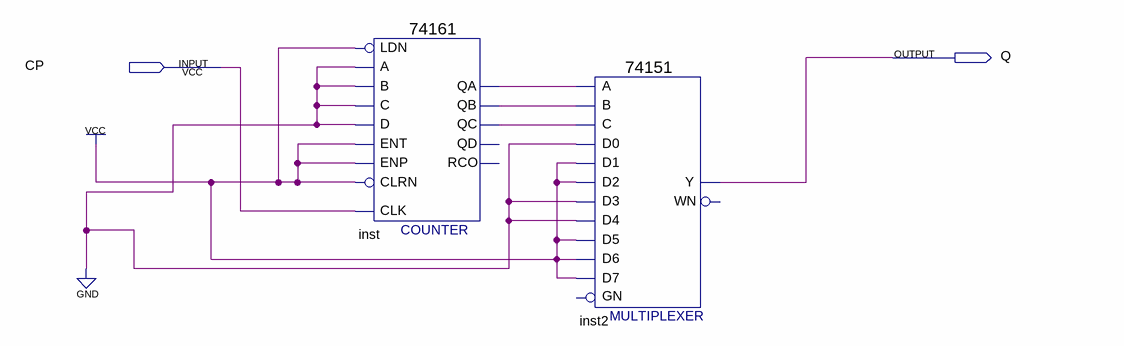
[diagram p0: schematic sheet]
// Quartus schematic 2.bdf as structural Verilog: 2 symbols, 2 pins
module \2  (
  input  CP,
  output Q
);

  wire inst_qa, inst_qb, inst_qc;

  \74161  inst (
    .CLRN(1'b1), .CLK(CP), .ENP(1'b1), .LDN(1'b1), .A(1'b0), .D(1'b0), .ENT(1'b1), .B(1'b0), .C(1'b0),
    .QC(inst_qc), .QB(inst_qb), .QA(inst_qa));  // open: QD, RCO
  \74151  inst2 (
    .C(inst_qc), .B(inst_qb), .A(inst_qa), .D5(1'b1), .D0(1'b0), .D1(1'b1), .D4(1'b0), .D3(1'b0), .D2(1'b1),
    .D6(1'b1), .D7(1'b1), .Y(Q));  // open: GN, WN
endmodule
